# Altium schematic sheet FTDI_&_USB.SchDoc: FTDI_USB
size 420 x 297 mm; DrawnBy: Orhun Dabak; Revision: 1.0; SheetNumber: 3; SheetTotal: 7; SPICEModelCacheUDHWENGR: <root> / <DocumentId>UDHWENGR</DocumentId> / <CacheFrame Number="0"> / <Model Name="emk105b7104_v-f" Kind="CKT"> / <Text>* EMK105B7104_V-F     SPICE MODEL  ( General Type ) / *-------------------------------------------------------------------------------------------------------- / * Model Generated by TAIYO YUDEN Corporation (http://www.ty-top.com) / * Version 1.0 / * TAIYO YUDEN Control No. 170508_060911 / * Copyright(c) 2012 TAIYO YUDEN CO.,LTD. All Rights Reserved. / *-------------------------------------------------------------------------------------------------------- / * / * Products Name : Multilayer Ceramic Capacitors / * / * Characteristics : / *     Capacitance : 0.1 uF , Rated Voltage : 16V , TCC : X7R / *     Case Size : 1.0 x 0.5 / 0.039 x 0.02 [mm/inch] , Thickness : 0.5 / 0.02 [mm/inch] / *     (Conditions: Temperature = 25 degC , DC Bias Current/Voltage = 0A / 0V) / * / * Frequency Range : 40Hz - 3GHz / * / * External Node Assignments : / * / *  1  o---| |---o  2 / * / *-------------------------------------------------------------------------------------------------------- / .SubCkt EMK105B7104_V-F 1 2 / **************************** / C0 1 110 0.078576u / Cm 1 101 9325p / C1 101 102 0.029504u / Rc1 101 102 20.922k / C2 102 103 0.015889u / Rc2 102 103 752.47 / C3 103 110 9030.9p / Rc3 103 110 42.225 / C2m 1 301 0.010371u / C21 301 302 0.22482u / Rc21 301 302 25.719k / C22 302 303 0.052111u / Rc22 302 303 73.689k / C23 303 304 0.075487u / Rc23 303 304 43.787k / C24 304 305 0.050427u / Rc24 304 305 2.2584k / C25 305 306 0.042135u / Rc25 305 306 2.2366k / C26 306 307 0.027488u / Rc26 306 307 1.4601k / C27 307 308 8717.3p / Rc27 307 308 231.75 / C28 308 309 8175.5p / Rc28 308 309 113.05 / C29 309 110 178.6p / Rc29 309 110 45.492 / Rp0 1 110 5G / L0 110 120 0.26393n / Lm 120 130 0.11117n / L1 120 121 0.031719n / RL1 121 130 1.0875 / L2 120 122 0.047268n / RL2 122 130 1.8421 / L3 120 123 0.48038n / RL3 123 130 1.1837 / CR 120 124 0.025618u / LR 124 125 0.058788n / RR 125 130 0.11414 / CL 130 140 2.3422p / LL 130 140 0.14249n / RL 130 140 315.53 / Rs 140 2 14.357m / **************************** / .ends EMK105B7104_V-F</Text> / </Model> / </CacheFrame> / </root>
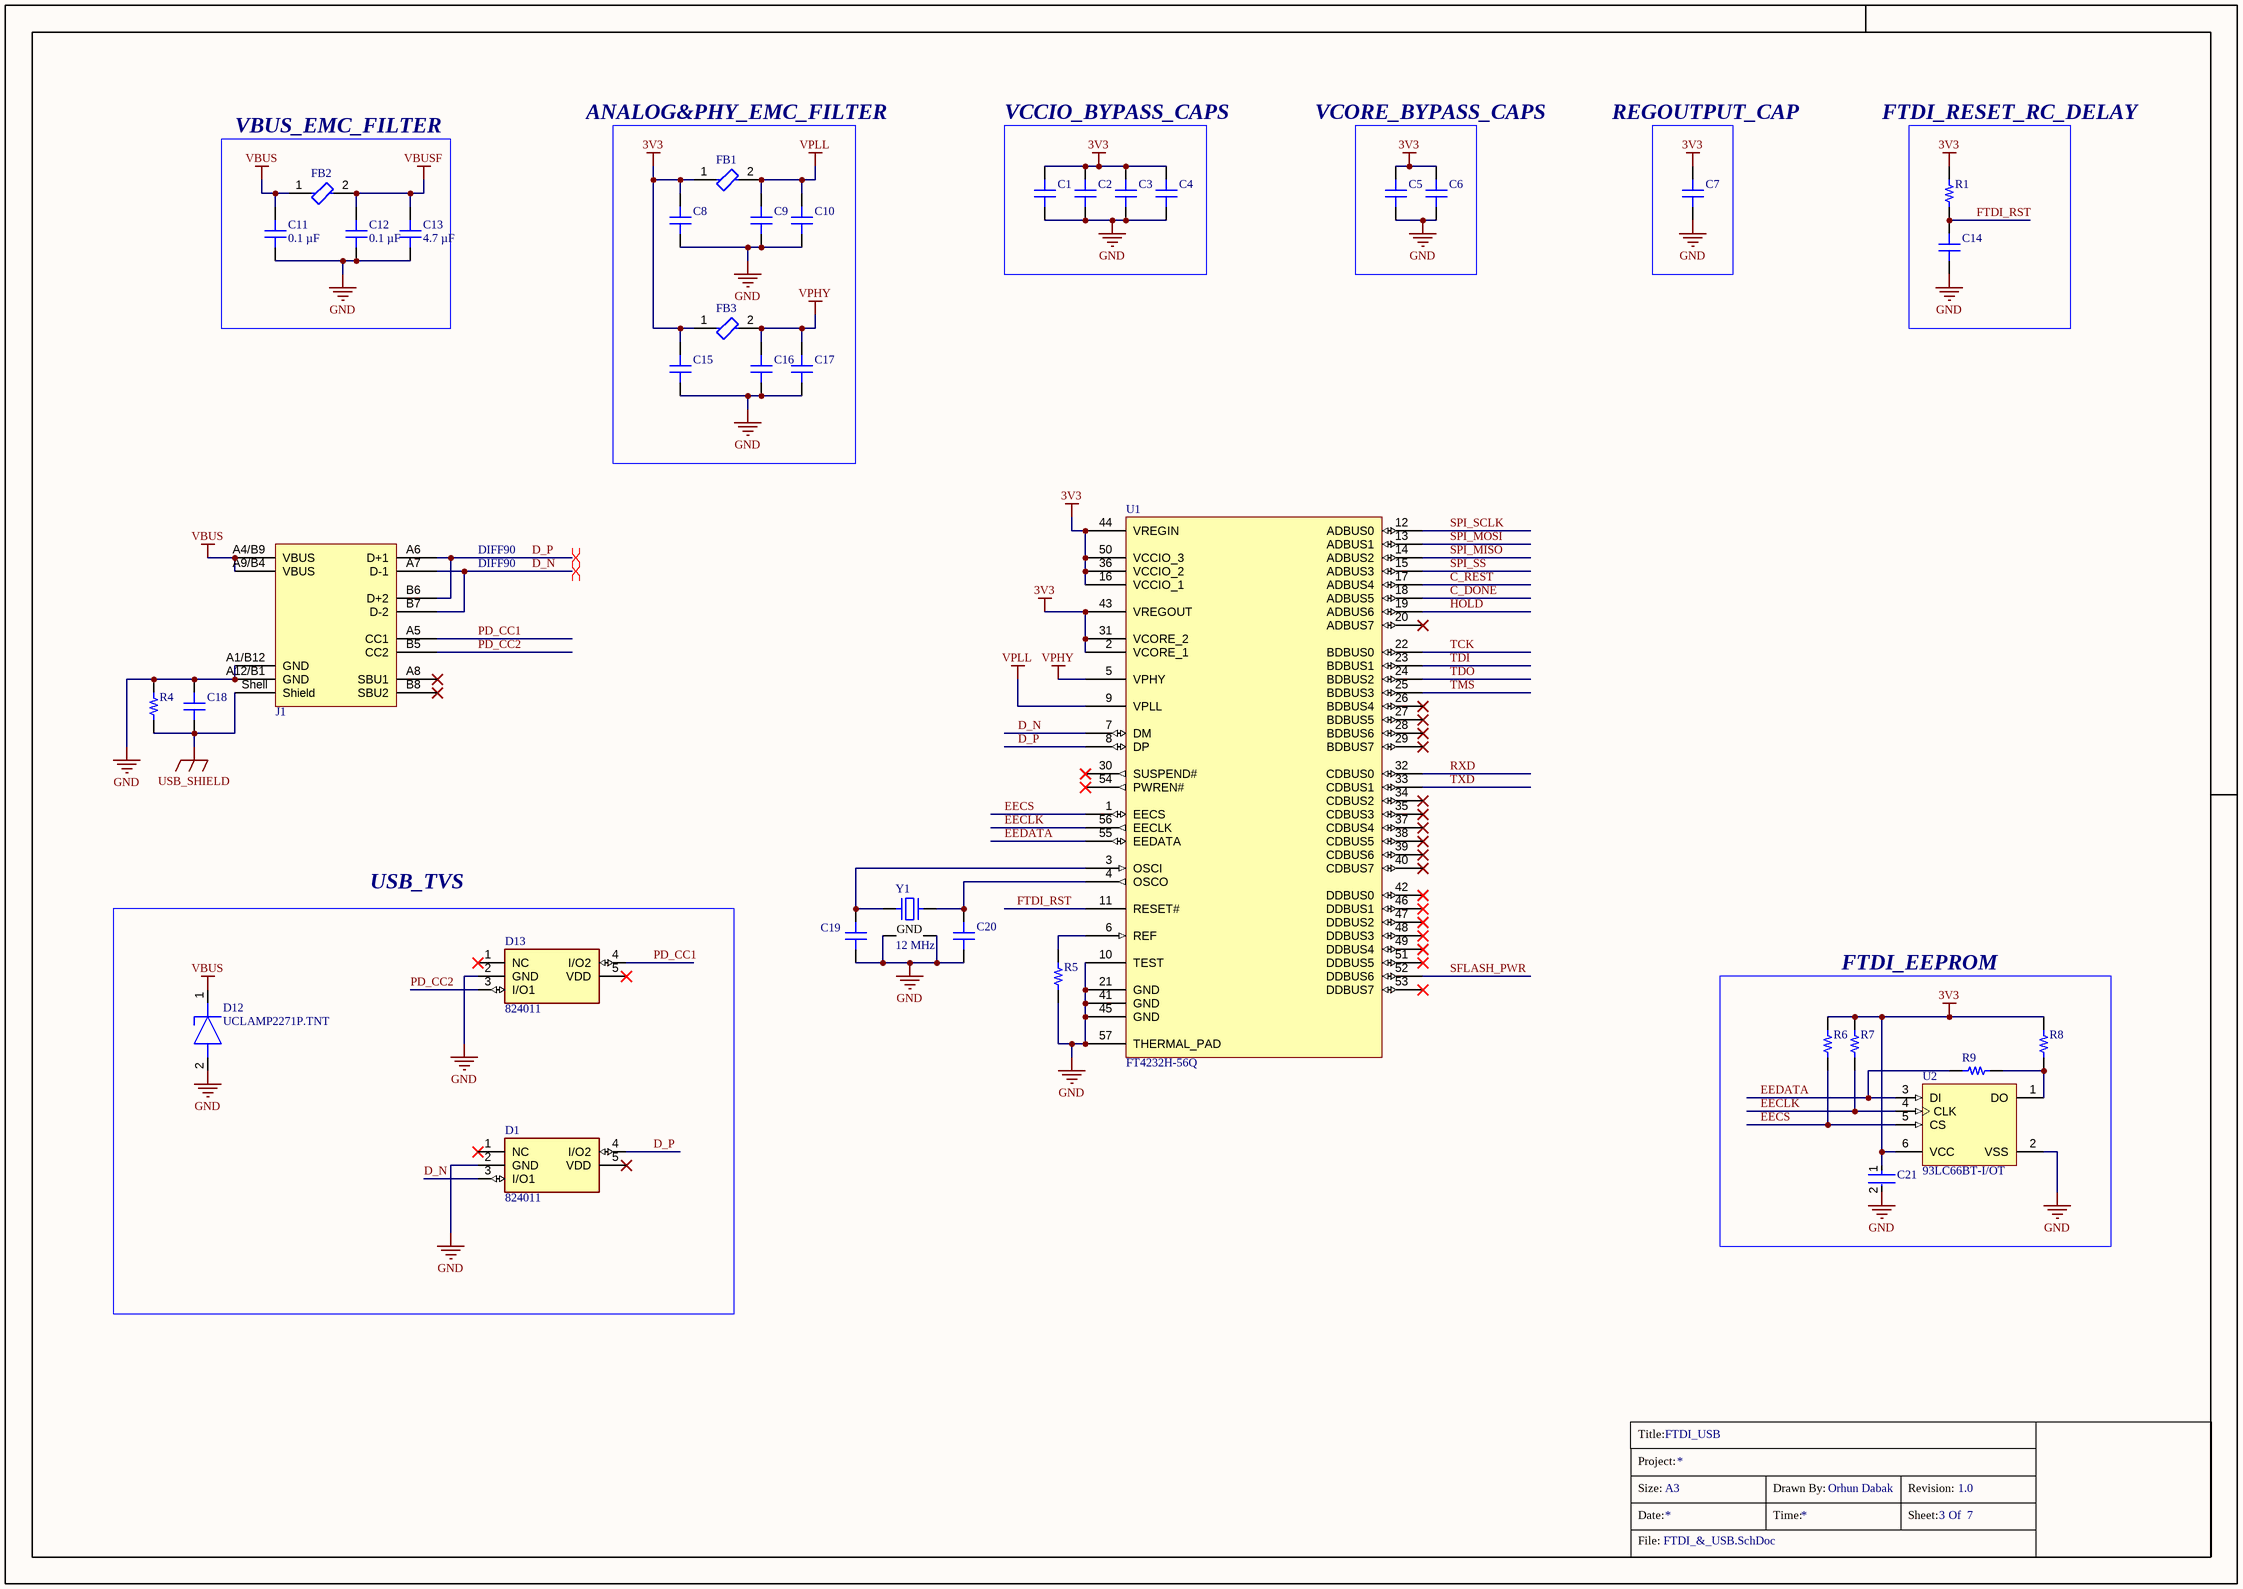
[diagram p0: FTDI_&_USB.SchDoc]

## Parts
?  (no value)  (graphical)
C1  0.1 µF  [CAP 0402_1005]  (value not drawn)
C2  0.1 µF  [CAP 0402_1005]  (value not drawn)
C3  0.1 µF  [CAP 0402_1005]  (value not drawn)
C4  0.1 µF  [CAP 0402_1005]  (value not drawn)
C5  0.1 µF  [CAP 0402_1005]  (value not drawn)
C6  0.1 µF  [CAP 0402_1005]  (value not drawn)
C7  4.7 µF  [CAP 0402_1005]  (value not drawn)
C8  0.1 µF  [CAP 0402_1005]  (value not drawn)
C9  0.1 µF  [CAP 0402_1005]  (value not drawn)
C10  4.7 µF  [CAP 0402_1005]  (value not drawn)
C11  0.1 µF  [CAP 0603_1608]
C12  0.1 µF  [CAP 0603_1608]
C13  4.7 µF  [CAP 1206_3216 - 0.8MM]
C14  0.1 µF  [CAP 0402_1005]  (value not drawn)
C15  0.1 µF  [CAP 0402_1005]  (value not drawn)
C16  0.1 µF  [CAP 0402_1005]  (value not drawn)
C17  4.7 µF  [CAP 0402_1005]  (value not drawn)
C18  10000 pF  [CAP 0402_1005]  (value not drawn)
C19  18 pF  [CAP 0201_0603]  (value not drawn)
C20  18 pF  [CAP 0201_0603]  (value not drawn)
C21  EMK105B7104KV-F  [FP-0402-L_1_0_0_05-W_0_5-MFG]  (value not drawn)
D1  824011  [SOT95P280X145-5N]
D12  UCLAMP2271P.TNT  [UCLAMP2271PTNT]
D13  824011  [SOT95P280X145-5N]
FB1  BLM15AX601SN1D  [FP-BLM15-0_05-IPC_B]  (value not drawn)
FB2  BLM18PG330SN1D  [FP-BLM18-0_15-t0_8-d1_2-MFG]  (value not drawn)
FB3  BLM15AX601SN1D  [FP-BLM15-0_05-IPC_B]  (value not drawn)
J1  629722000214  [629722000214]  (value not drawn)
R1  1 kOhms  [RES 0201_0603]  (value not drawn)
R4  1 MOhms  [RES 0402_1005]  (value not drawn)
R5  12 kOhms  [RES 0201_0603]  (value not drawn)
R6  10 kOhms  [RES 0201_0603]  (value not drawn)
R7  10 kOhms  [RES 0201_0603]  (value not drawn)
R8  10 kOhms  [RES 0201_0603]  (value not drawn)
R9  2.2 kOhms  [RES 0201_0603]  (value not drawn)
U1  FT4232H-56Q  [QFN50P800X800X100-57N-D]
U2  93LC66BT-I/OT  [SOT-23-OT6_N]
Y1  12 MHz  [NDK NX3225GA]

## Blocks framed on the sheet
VBUS_EMC_FILTER: C11-C13 FB2
VCCIO_BYPASS_CAPS: C1-C4
USB_TVS: D1 D12 D13
FTDI_EEPROM: C21 R6-R9 U2

## Nets
3V3: C1.2 C2.2 C3.2 C4.2 C5.2 C6.2 C7.2 C8.2 C15.2 C21.1 FB1.1 FB3.1 R1.2 R6.2 R7.2 R8.2 U1.2(VCORE_1) U1.16(VCCIO_1) U1.31(VCORE_2) U1.36(VCCIO_2) U1.43(VREGOUT) U1.44(VREGIN) U1.50(VCCIO_3) U2.6(VCC)
GND: C1.1 C2.1 C3.1 C4.1 C5.1 C6.1 C7.1 C8.1 C9.1 C10.1 C11.1 C12.1 C13.1 C14.1 C15.1 C16.1 C17.1 C18.2 C19.1 C20.2 C21.2 D1.2(GND) D12.2(A) D13.2(GND) J1.A1/B12(GND) J1.A12/B1(GND) R4.2 R5.1 U1.10(TEST) U1.21(GND) U1.41(GND) U1.45(GND) U1.57(THERMAL_PAD) U2.2(VSS) Y1.2(GND) Y1.4(GND)
USB_SHIELD: C18.1 J1.Shell(Shield) R4.1
VBUS: C11.2 D12.1(K) FB2.1 J1.A4/B9(VBUS) J1.A9/B4(VBUS)
VBUSF: C12.2 C13.2 FB2.2
VPHY: C16.2 C17.2 FB3.2 U1.5(VPHY)
VPLL: C9.2 C10.2 FB1.2 U1.9(VPLL)
C_DONE: U1.18(ADBUS5)
C_REST: U1.17(ADBUS4)
D_N: D1.3(I/O1) J1.A7(D-1) J1.B7(D-2) U1.7(DM)
D_P: D1.4(I/O2) J1.A6(D+1) J1.B6(D+2) U1.8(DP)
EECLK: R7.1 U1.56(EECLK) U2.4(CLK)
EECS: R6.1 U1.1(EECS) U2.5(CS)
EEDATA: R9.1 U1.55(EEDATA) U2.3(DI)
FTDI_RST: C14.2 R1.1 U1.11(RESET#)
HOLD: U1.19(ADBUS6)
PD_CC1: D13.4(I/O2) J1.A5(CC1)
PD_CC2: D13.3(I/O1) J1.B5(CC2)
RXD: U1.32(CDBUS0)
SFLASH_PWR: U1.52(DDBUS6)
SPI_MISO: U1.14(ADBUS2)
SPI_MOSI: U1.13(ADBUS1)
SPI_SCLK: U1.12(ADBUS0)
SPI_SS: U1.15(ADBUS3)
TCK: U1.22(BDBUS0)
TDI: U1.23(BDBUS1)
TDO: U1.24(BDBUS2)
TMS: U1.25(BDBUS3)
TXD: U1.33(CDBUS1)
NetC19_2: C19.2 U1.3(OSCI) Y1.1
NetC20_1: C20.1 U1.4(OSCO) Y1.3
NetR5_2: R5.2 U1.6(REF)
NetR8_1: R8.1 R9.2 U2.1(DO)

Not connected (* = marked no-connect by the designer): D1 1(NC)* 5(VDD)*; D13 1(NC)* 5(VDD)*; J1 A8(SBU1)* B8(SBU2)*; U1 20(ADBUS7)* 26(BDBUS4)* 27(BDBUS5)* 28(BDBUS6)* 29(BDBUS7)* 30(SUSPEND#)* 34(CDBUS2)* 35(CDBUS3)* 37(CDBUS4)* 38(CDBUS5)* 39(CDBUS6)* 40(CDBUS7)* 42(DDBUS0)* 46(DDBUS1)* 47(DDBUS2)* 48(DDBUS3)* 49(DDBUS4)* 51(DDBUS5)* 53(DDBUS7)* 54(PWREN#)*

## Layout directives
differential pair; differential pair class DIFF90: D_N, D_P

## Notes on the sheet
- ANALOG&PHY_EMC_FILTER
- VCORE_BYPASS_CAPS
- REGOUTPUT_CAP
- FTDI_RESET_RC_DELAY
- Title:
- Project:
- Size:
- Date:
- File:
- A3
- Time:
- Drawn By:
- Sheet:
- Revision:
- Of

## Library data of the parts
? = Title_Block
C1-C6 C8 C9 C14-C16 = CC0402KRX7R6BB104: CAP CER 0.1UF 10V X7R 0402; manufacturer: Yageo; Tolerance: ±10%; Part Number: CC0402KRX7R6BB104; Value: 0.1 µF; Applications: General Purpose; Capacitance: 0.1 µF; componentlink1description: Datasheet; componentlink1url: https://www.yageo.com/upload/media/product/productsearch/datasheet/mlcc/UPY-GPHC_X7R_6.3V-to-50V_18.pdf; componentlink2description: DigiKey Link; componentlink2url: https://www.digikey.com/en/products/detail/yageo/CC0402KRX7R6BB104/2103083; Device Package: 0402 (1005 Metric); lastupdated: 19/09/2022 12:57:28; Lifecycle Status: Active; Minimum Order: 1; Mounting Type: Surface Mount, MLCC; Operating Temperature: -55°C ~ 125°C; Package / Case: 0402 (1005 Metric); packaging: CutTape; partid: 3877; Part Status: Active; price: 0.01; series: CC; Size / Dimension: 0.039" L x 0.020" W (1.00mm x 0.50mm); Supplier 1: DigiKey; Supplier Part Number 1: 311-1345-1-ND; Temperature Coefficient: X7R; Thickness (Max): 0.022" (0.55mm); Voltage - Rated: 10V
C7 C10 C17 = CL05A475MP5NRNC: CAP CER 4.7UF 10V X5R 0402; manufacturer: Samsung Electro-Mechanics; Tolerance: ±20%; Part Number: CL05A475MP5NRNC; Value: 4.7 µF; Applications: General Purpose; Capacitance: 4.7 µF; componentlink1description: Datasheet; componentlink1url: http://www.samsungsem.com/kr/support/product-search/mlcc/CL05A475MP5NRNC.jsp; componentlink2description: DigiKey Link; componentlink2url: https://www.digikey.com/en/products/detail/samsung-electro-mechanics/CL05A475MP5NRNC/3887140; Device Package: 0402 (1005 Metric); lastupdated: 19/09/2022 12:57:17; Lifecycle Status: Active; Minimum Order: 1; Mounting Type: Surface Mount, MLCC; Operating Temperature: -55°C ~ 85°C; Package / Case: 0402 (1005 Metric); packaging: TapeAndReel; partid: 7650; Part Status: Active; price: 0.01; series: CL; Size / Dimension: 0.039" L x 0.020" W (1.00mm x 0.50mm); Supplier 1: DigiKey; Supplier Part Number 1: 1276-1482-1-ND; Temperature Coefficient: X5R; Thickness (Max): 0.022" (0.55mm); Voltage - Rated: 10V
C11 C12 = C0603X104M3RAC7867: CAP CER 0.1UF 25V X7R 0603; manufacturer: KEMET; Tolerance: ±20%; Part Number: C0603X104M3RAC7867; Value: 0.1 µF; Applications: Boardflex Sensitive; Capacitance: 0.1 µF; componentlink1description: Datasheet; componentlink1url: https://api.kemet.com/component-edge/download/datasheet/C0603X104M3RACTU.pdf; componentlink2description: DigiKey Link; componentlink2url: https://www.digikey.com/en/products/detail/kemet/C0603X104M3RAC7867/2202613; Device Package: 0603 (1608 Metric); Features: Soft Termination; lastupdated: 9/19/2022 01:01:19 PM; Lifecycle Status: Active; Minimum Order: 1; Mounting Type: Surface Mount, MLCC; Operating Temperature: -55°C ~ 125°C; Package / Case: 0603 (1608 Metric); packaging: TapeAndReel; partid: 2484; Part Status: Active; price: 0.07; series: SMD Comm X7R Flex; Size / Dimension: 0.063" L x 0.031" W (1.60mm x 0.80mm); Supplier 1: DigiKey; Supplier Part Number 1: 399-13148-1-ND; Temperature Coefficient: X7R; Thickness (Max): 0.034" (0.87mm); Voltage - Rated: 25V
C13 = CL31B475KBHVPNE: CAP CER 4.7UF 50V X7R 1206; manufacturer: Samsung Electro-Mechanics; Tolerance: ±10%; Part Number: CL31B475KBHVPNE; Value: 4.7 µF; Applications: Automotive; Capacitance: 4.7 µF; componentlink1description: Datasheet; componentlink1url: http://www.samsungsem.com/kr/support/product-search/mlcc/CL31B475KBHVPNE.jsp; componentlink2description: DigiKey Link; componentlink2url: https://www.digikey.com/en/products/detail/samsung-electro-mechanics/CL31B475KBHVPNE/5961265; Device Package: 1206 (3216 Metric); lastupdated: 9/19/2022 01:06:52 PM; Lifecycle Status: Active; Minimum Order: 1; Mounting Type: Surface Mount, MLCC; Operating Temperature: -55°C ~ 125°C; Package / Case: 1206 (3216 Metric); packaging: TapeAndReel; partid: 19596; Part Status: Active; price: 0.08; Ratings: AEC-Q200; series: CL; Size / Dimension: 0.126" L x 0.063" W (3.20mm x 1.60mm); Supplier 1: DigiKey; Supplier Part Number 1: 1276-6781-1-ND; Temperature Coefficient: X7R; Thickness (Max): 0.071" (1.80mm); Voltage - Rated: 50V
C18 = CC0402KRX7R0BB103: CAP CER 10000PF 100V X7R 0402; manufacturer: Yageo; Tolerance: ±10%; Part Number: CC0402KRX7R0BB103; Value: 10000 pF; Applications: General Purpose; Capacitance: 10000 pF; componentlink1description: Datasheet; componentlink1url: https://www.yageo.com/upload/media/product/productsearch/datasheet/mlcc/UPY-NP0X7R_MV_100-to-630V_24.pdf; componentlink2description: DigiKey Link; componentlink2url: https://www.digikey.com/en/products/detail/yageo/CC0402KRX7R0BB103/11489823; Device Package: 0402 (1005 Metric); lastupdated: 19/09/2022 12:56:51; Lifecycle Status: Active; Minimum Order: 1; Mounting Type: Surface Mount, MLCC; Operating Temperature: -55°C ~ 125°C; Package / Case: 0402 (1005 Metric); packaging: TapeAndReel; partid: 33421; Part Status: Active; price: 0.01; series: CC; Size / Dimension: 0.039" L x 0.020" W (1.00mm x 0.50mm); Supplier 1: DigiKey; Supplier Part Number 1: 13-CC0402KRX7R0BB103CT-ND; Temperature Coefficient: X7R; Thickness (Max): 0.022" (0.55mm); Voltage - Rated: 100V
C19 C20 = GRM0335C1H180JA01D: CAP CER 18PF 50V C0G/NP0 0201; manufacturer: Murata Electronics; Temperature Coefficient: C0G, NP0; Tolerance: ±5%; Part Number: GRM0335C1H180JA01D; Value: 18 pF; Applications: General Purpose; Capacitance: 18 pF; componentlink1description: Datasheet; componentlink1url: https://search.murata.co.jp/Ceramy/image/img/A01X/G101/ENG/GRM0335C1H180JA01-01.pdf; componentlink2description: DigiKey Link; componentlink2url: https://www.digikey.com/en/products/detail/murata-electronics/GRM0335C1H180JA01D/2269170; Device Package: 0201 (0603 Metric); lastupdated: 19/09/2022 12:54:27; Lifecycle Status: Active; Minimum Order: 1; Mounting Type: Surface Mount; Operating Temperature: -55°C ~ 125°C; Package / Case: 0201 (0603 Metric); packaging: CutTape; partid: 881; Part Status: Active; price: 0.01; series: GRM; Size / Dimension: 0.024" L x 0.012" W (0.60mm x 0.30mm); Supplier 1: DigiKey; Supplier Part Number 1: 490-6117-1-ND; Thickness (Max): 0.013" (0.33mm); Voltage - Rated: 50V
C21 = CMP-14477-000055-2: None; Voltage Rating: 16V; Tolerance: 10%; Dielectric: X7R; Capacitance: 100nF; Width: 0.02inch; RoHS Compliant: Yes; Resistor Type: Ceramic; Radiation Hardening: No; Case Code (Imperial): 0402; Height: 0.5mm; Case Code (Metric): 1005; Halogen Free: Halogen Free; Series: M; Thickness: 0.022inch; Case/Package: 0402; Construction: Flat; Mount: Surface Mount; Voltage Rating (DC): 16V; Depth: 0.5mm; Min Operating Temperature: -55°C; Package Quantity: 1; Packaging: Tape and Reel; Termination: SMD/SMT; Length: 1mm; Max Operating Temperature: 125°C; Lead Free: Lead Free; Number of Pins: 2
D1 D13 = 824011: Diode; Manufacturer_Name: Wurth Elektronik; Datasheet Link: http://katalog.we-online.com/pbs/datasheet/824011.pdf; Height: 1.45mm; Manufacturer_Part_Number: 824011; Mouser Part Number: 710-824011; Mouser Price/Stock: https://www.mouser.co.uk/ProductDetail/Wurth-Elektronik/824011?qs=Wn16VcyqZWrHR48Vn%2FB8%252Bg%3D%3D
D12 = UCLAMP2271P.TNT: Diode ESD (Uni-directional); Manufacturer_Name: SEMTECH; Datasheet Link: https://datasheet.datasheetarchive.com/originals/distributors/DKDS40/DSANUWW0015.pdf; Height: 0.55mm; Manufacturer_Part_Number: UCLAMP2271P.TNT; Mouser Part Number: 947-UCLAMP2271P.TNT; Mouser Price/Stock: https://www.mouser.co.uk/ProductDetail/Semtech/UCLAMP2271PTNT?qs=rBWM4%252BvDhIfNW1LNkYoyJw%3D%3D; Arrow Part Number: UCLAMP2271P.TNT; Arrow Price/Stock: https://www.arrow.com/en/products/uclamp2271p.tnt/semtech?region=nac
FB1 FB3 = CMP-0686-00246-4: Chip Ferrite Bead, 0402, 600Ω @ 100MHz, 0.34Ω, 25%, 500mA; Material: Steel; DC Resistance (DCR): 340mR; Impedance: 600R; Number of Circuits: 1; Max Current Rating: 500mA; Core Material: Ferrite; Lead Free: Lead Free; Series: BLM15AX_SN; Number of Pins: 2; Package Quantity: 1; Length: 1mm; Height: 0.5mm; Width: 0.5mm; Packaging: Tape and Reel; RoHS Compliant: Yes; Test Frequency: 100MHz; Case Code (Imperial): 0402; Depth: 0.5mm; Case/Package: 0402; Min Operating Temperature: -55°C; Max Operating Temperature: 125°C; Max DC Current: 500mA; Current Rating: 500mA; REACH SVHC: No SVHC; Termination: SMD/SMT; Tolerance: 25%; Case Code (Metric): 1005; Number of Lines: 1; DC Resistance-Max: 340mR
FB2 = CMP-0686-00590-4: Chip Ferrite Bead, 0603, 33Ω @ 100MHz, 0.025Ω, 25%, 3A; Manufacturer Series: BLM18P; Shielding: Unshielded; Number of Functions: 1; Resistance: 25mR; ESR (Equivalent Series Resistance): 33R; Material: Steel; Packaging: Tape and Reel; Test Frequency: 100MHz; Length: 1.6mm; DC Current: 3A; Height: 0.8mm; Current Rating: 3A; Case/Package: 0603; Number of Lines: 1; Lead Free: Lead Free; RoHS Compliant: Yes; Max Current Rating: 3A; Case Code (Metric): 1608; Core Material: Ferrite; REACH SVHC: No SVHC; Min Operating Temperature: -55°C; Number of Pins: 2; DC Resistance (DCR): 25mR; Number of Circuits: 1; Series: BLM18P; Radiation Hardening: No; Max DC Current: 3A; Depth: 0.8mm; Terminal Finish: Tin; Package Quantity: 1; Case Code (Imperial): 0603; Impedance: 33R; Tolerance: 25%; Width: 0.8mm; Termination: SMD/SMT; DC Resistance-Max: 25mR; Max Operating Temperature: 125°C
J1 = 629722000214: WR-USB 2.0 Type C, Receptacle, Horizontal, SMT; Manufacturer: Wurth Elektronik; Interface Type: Type C; Number of Ports: 1; Rated Current: 5A; Working Voltage: 20VAC; ComponentLink1Description: Website Link; ComponentLink1URL: https://www.we-online.com/redexpert/article/629722000214?ad; ComponentLink2Description: Datasheet Link; ComponentLink2URL: https://www.we-online.com/redexpert/spec/629722000214?ad; Manufacturer Part Number: 629722000214; Category: Input/Output Connectors; Match Code: WR-USB; Mount: Surface Mount; Operating Temperature Max: 85°C; Operating Temperature Min: -40°C; Packaging: Tape and Reel; Application: USB 2.0; Gender: Receptacle; Number of Pins: 16; Orientation: Horizontal
R1 = RC0201FR-071KL: RES 1K OHM 1% 1/20W 0201; Manufacturer: Yageo; Power (Watts): 0.05W, 1/20W; Temperature Coefficient: ±200ppm/°C; Part Number: RC0201FR-071KL; Value: 1 kOhms; ComponentLink1Description: Datasheet; ComponentLink1URL: https://www.yageo.com/upload/media/product/productsearch/datasheet/rchip/PYu-RC_Group_51_RoHS_L_10.pdf; ComponentLink2Description: DigiKey Link; ComponentLink2URL: https://www.digikey.com/en/products/detail/yageo/RC0201FR-071KL/3202389; Composition: Thick Film; Device Package: 0201 (0603 Metric); Features: Moisture Resistant; Height - Seated (Max): 0.010" (0.26mm); LastUpdated: 19/09/2022 13:09:03; Lifecycle Status: Active; Minimum Order: 1; Number of Terminations: 2; Operating Temperature: -55°C ~ 125°C; Package / Case: 0201 (0603 Metric); Packaging: CutTape; PartId: 2286; Part Status: Active; Price: 0.01; Resistance: 1 kOhms; Series: RC_L; Size / Dimension: 0.024" L x 0.012" W (0.60mm x 0.30mm); Supplier 1: DigiKey; Supplier Part Number 1: 311-1KMCT-ND; Supplier Device Package: 0201; Tolerance: ±1%
R4 = AC0402FR-071ML: RES SMD 1M OHM 1% 1/16W 0402; Manufacturer: Yageo; Power (Watts): 0.063W, 1/16W; Temperature Coefficient: ±100ppm/°C; Part Number: AC0402FR-071ML; Value: 1 MOhms; ComponentLink1Description: Datasheet; ComponentLink1URL: https://www.yageo.com/upload/media/product/productsearch/datasheet/rchip/PYu-AC_51_RoHS_L_7.pdf; ComponentLink2Description: DigiKey Link; ComponentLink2URL: https://www.digikey.com/en/products/detail/yageo/AC0402FR-071ML/5895164; Composition: Thick Film; Device Package: 0402 (1005 Metric); Features: Automotive AEC-Q200, Moisture Resistant; Height - Seated (Max): 0.015" (0.37mm); LastUpdated: 19/09/2022 13:14:31; Lifecycle Status: Active; Minimum Order: 1; Number of Terminations: 2; Operating Temperature: -55°C ~ 155°C; Package / Case: 0402 (1005 Metric); Packaging: CutTape; PartId: 12043; Part Status: Active; Price: 0.01; Ratings: AEC-Q200; Resistance: 1 MOhms; Series: AC; Size / Dimension: 0.039" L x 0.020" W (1.00mm x 0.50mm); Supplier 1: DigiKey; Supplier Part Number 1: YAG3450CT-ND; Supplier Device Package: 0402; Tolerance: ±1%
R5 = RC0201FR-0712KL: RES 12K OHM 1% 1/20W 0201; Manufacturer: Yageo; Power (Watts): 0.05W, 1/20W; Temperature Coefficient: ±200ppm/°C; Part Number: RC0201FR-0712KL; Value: 12 kOhms; ComponentLink1Description: Datasheet; ComponentLink1URL: https://www.yageo.com/upload/media/product/productsearch/datasheet/rchip/PYu-RC_Group_51_RoHS_L_10.pdf; ComponentLink2Description: DigiKey Link; ComponentLink2URL: https://www.digikey.com/en/products/detail/yageo/RC0201FR-0712KL/1948886; Composition: Thick Film; Device Package: 0201 (0603 Metric); Features: Moisture Resistant; Height - Seated (Max): 0.010" (0.26mm); LastUpdated: 19/09/2022 13:09:10; Lifecycle Status: Active; Minimum Order: 1; Number of Terminations: 2; Operating Temperature: -55°C ~ 125°C; Package / Case: 0201 (0603 Metric); Packaging: CutTape; PartId: 1388; Part Status: Active; Price: 0.01; Resistance: 12 kOhms; Series: RC_L; Size / Dimension: 0.024" L x 0.012" W (0.60mm x 0.30mm); Supplier 1: DigiKey; Supplier Part Number 1: 311-12.0KMCT-ND; Supplier Device Package: 0201; Tolerance: ±1%
R6-R8 = RC0201FR-0710KL: RES 10K OHM 1% 1/20W 0201; Manufacturer: Yageo; Power (Watts): 0.05W, 1/20W; Temperature Coefficient: ±200ppm/°C; Part Number: RC0201FR-0710KL; Value: 10 kOhms; ComponentLink1Description: Datasheet; ComponentLink1URL: https://www.yageo.com/upload/media/product/productsearch/datasheet/rchip/PYu-RC_Group_51_RoHS_L_10.pdf; ComponentLink2Description: DigiKey Link; ComponentLink2URL: https://www.digikey.com/en/products/detail/yageo/RC0201FR-0710KL/1948870; Composition: Thick Film; Device Package: 0201 (0603 Metric); Features: Moisture Resistant; Height - Seated (Max): 0.010" (0.26mm); LastUpdated: 19/09/2022 13:09:03; Lifecycle Status: Active; Minimum Order: 1; Number of Terminations: 2; Operating Temperature: -55°C ~ 125°C; Package / Case: 0201 (0603 Metric); Packaging: CutTape; PartId: 2281; Part Status: Active; Price: 0.01; Resistance: 10 kOhms; Series: RC_L; Size / Dimension: 0.024" L x 0.012" W (0.60mm x 0.30mm); Supplier 1: DigiKey; Supplier Part Number 1: 311-10.0KMCT-ND; Supplier Device Package: 0201; Tolerance: ±1%
R9 = RC0201JR-072K2L: RES 2.2K OHM 5% 1/20W 0201; Manufacturer: Yageo; Power (Watts): 0.05W, 1/20W; Temperature Coefficient: ±200ppm/°C; Part Number: RC0201JR-072K2L; Value: 2.2 kOhms; ComponentLink1Description: Datasheet; ComponentLink1URL: https://www.yageo.com/upload/media/product/productsearch/datasheet/rchip/PYu-RC_Group_51_RoHS_L_10.pdf; ComponentLink2Description: DigiKey Link; ComponentLink2URL: https://www.digikey.com/en/products/detail/yageo/RC0201JR-072K2L/1948938; Composition: Thick Film; Device Package: 0201 (0603 Metric); Features: Moisture Resistant; Height - Seated (Max): 0.010" (0.26mm); LastUpdated: 19/09/2022 13:08:59; Lifecycle Status: Active; Minimum Order: 1; Number of Terminations: 2; Operating Temperature: -55°C ~ 125°C; Package / Case: 0201 (0603 Metric); Packaging: CutTape; PartId: 3184; Part Status: Active; Price: 0.01; Resistance: 2.2 kOhms; Series: RC_L; Size / Dimension: 0.024" L x 0.012" W (0.60mm x 0.30mm); Supplier 1: DigiKey; Supplier Part Number 1: 311-2.2KNCT-ND; Supplier Device Package: 0201; Tolerance: ±5%
U1 = FT4232H-56Q: USB Bridge, USB to UART,FIFO USB 2.0 FIFO Interface 56-VQFN (8x8); Manufacturer: FTDI, Future Technology Devices International Ltd; Manufacturer Product Number: FT4232H-56Q-REEL; Standards: USB 2.0; Voltage - Supply: 3.3V; Supplier 1: Digi-Key; Supplier Part Number 1: 768-1378-1-ND; Supplier 2: Digi-Key; Supplier Part Number 2: 768-1378-6-ND; Supplier 3: RSComponents; Supplier Part Number 3: 1115836; Series: -; Protocol: USB; Function: Bridge, USB to UART,FIFO; Interface: FIFO; Current - Supply: -; ComponentLink1Description: Datasheet; ComponentLink1URL: https://www.ftdichip.com/Support/Documents/DataSheets/ICs/DS_FT4232H.pdf; ComponentLink2Description: Digi-Key Link; ComponentLink2URL: https://www.digikey.com/en/products/detail/ftdi-future-technology-devices-international-ltd/FT4232H-56Q-REEL/5994692; Operating Temperature: -40°C ~ 85°C; Package / Case: 56-VFQFN Exposed Pad; Supplier Device Package: 56-VQFN (8x8)
U2 = CMP-019-00051-3: Microwire Serial EEPROM Family, 2.5Vto 5.5V' 2 MHz, -40°Cto 125°C, SOT-23-6, RoHS
Y1 = NX3225GA-12MHZ-STD-CRG-2: CRYSTAL 12.0000MHZ 8PF SMD; Manufacturer: NDK America, Inc.; ESR (Equivalent Series Resistance): 100 Ohms; Frequency Stability: ±30ppm; Frequency Tolerance: ±20ppm; Operating Mode: Fundamental; Part Number: NX3225GA-12MHZ-STD-CRG-2; ComponentLink1Description: Datasheet; ComponentLink1URL: http://www.ndk.com/images/products/catalog/c_NX3225GA-STD-CRG-2_e.pdf; ComponentLink2Description: DigiKey Link; ComponentLink2URL: https://www.digikey.com/en/products/detail/ndk-america-inc/NX3225GA-12MHZ-STD-CRG-2/3125632; Frequency: 12 MHz; Height - Seated (Max): 0.035" (0.90mm); LastUpdated: 19/09/2022 13:51:54; Lifecycle Status: Active; Load Capacitance: 8pF; Minimum Order: 1; Mounting Type: Surface Mount; Operating Temperature: -40°C ~ 85°C; Package / Case: 4-SMD, No Lead; Packaging: TapeAndReel; PartId: 551; Part Status: Active; Price: 0.33; Series: NX3225GA; Size / Dimension: 0.126" L x 0.098" W (3.20mm x 2.50mm); Supplier 1: DigiKey; Supplier Part Number 1: 644-1173-1-ND; Type: MHz Crystal; Value: 12 MHz